# Altium schematic sheet Power.SchDoc
size A4; SheetNumber: 4; SheetTotal: 4
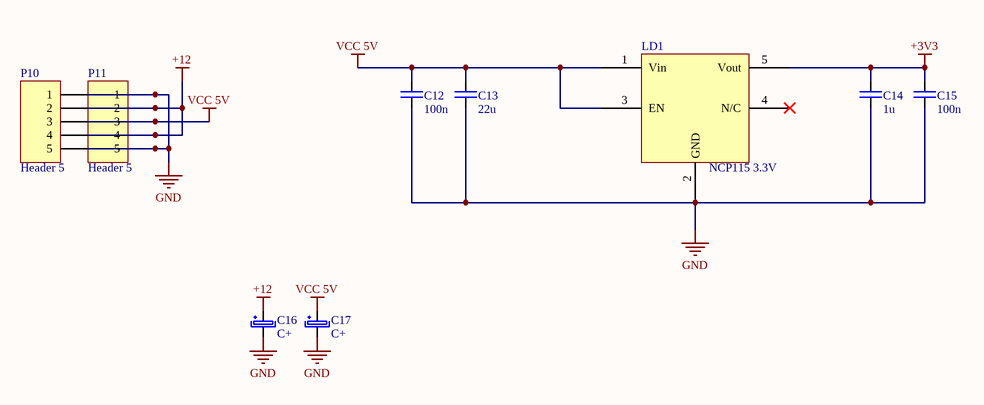
[diagram p0: Power.SchDoc]

## Parts
C12  100n  [R1005_0402i_L]
C13  22u  [C1608_0603I_L]
C14  1u  [R1005_0402i_L]
C15  100n  [R1005_0402i_L]
C16  C+  [C AlElko 5x11 R2]
C17  C+  [C AlElko 5x11 R2]
LD1  NCP115 3.3V  [TSOP95P280X110-6L]
P10  Header 5  [HDR1X5]
P11  Header 5  [HDR1X5]

## Nets
+3V3: C14.1 C15.1 LD1.5(Vout)
+12: C16.1 P10.2 P10.4 P11.2 P11.4
GND: C12.2 C13.2 C14.2 C15.2 C16.2 C17.2 LD1.2(GND) P10.1 P10.5 P11.1 P11.5
VCC 5V: C12.1 C13.1 C17.1 LD1.1(Vin) LD1.3(EN) P10.3 P11.3

Not connected (* = marked no-connect by the designer): LD1 4(N/C)*

## Library data of the parts
C12-C15 = C: Capacitor
C16 C17 = C+: Capacitor Polarized
P10 P11 = Header 5: Header, 5-Pin; LatestRevisionDate: 17-Jul-2002; LatestRevisionNote: Re-released for DXP Platform.; Publisher: Altium Limited